# EAGLE design untitled (EAGLE 9.5.2)
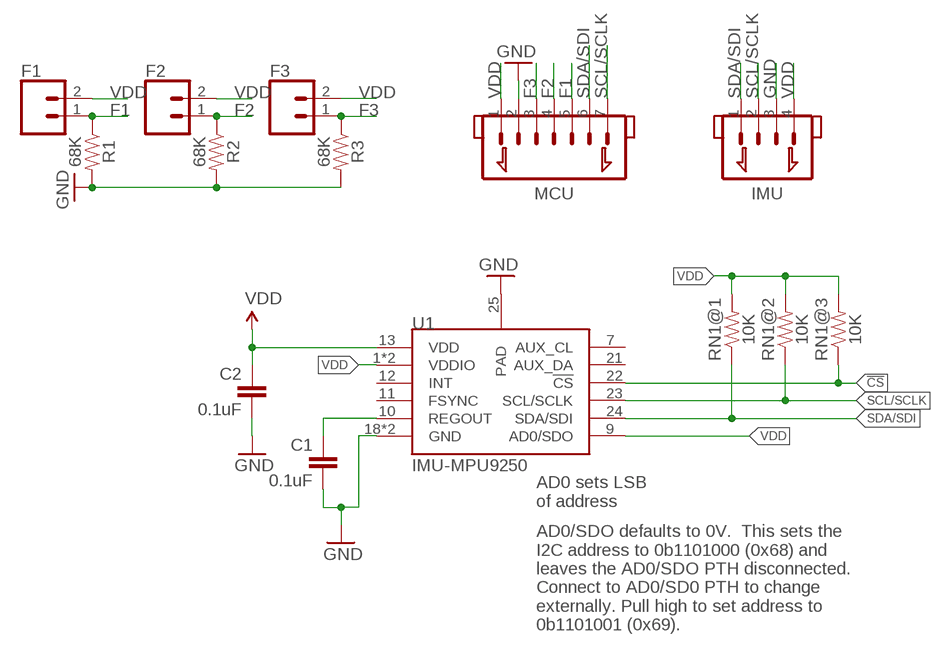
[diagram p0: schematic, sheet 1]

## Parts
C1  0.1uF  0.1UF-25V(+80/-20%)(0603)  [0603-CAP]
C2  0.1uF  0.1UF-25V(+80/-20%)(0603)  [0603-CAP]
F1  CONN_02LOCK_LONGPADS  [1X02_LOCK_LONGPADS]
F2  CONN_02LOCK_LONGPADS  [1X02_LOCK_LONGPADS]
F3  CONN_02LOCK_LONGPADS  [1X02_LOCK_LONGPADS]
IMU  JST_1.25_4P  [JST1.25_4P]
MCU  JST_1.25_7P  [JST1.25_7P]
R1  68K  RESISTOR0603  [0603]
R2  68K  RESISTOR0603  [0603]
R3  68K  RESISTOR0603  [0603]
RN1  10K  RESISTOR_ARRAY_1206_SEPARATE  [RESCAF80P320X160X60-8N]
U1  IMU-MPU9250  [LEAD-QFN24]

## Nets
!CS: RN1.3 U1.22(!CS)
F1: F1.1 MCU.5 R1.1
F2: F2.1 MCU.4 R2.1
F3: F3.1 MCU.3 R3.1
GND: C1.2 C2.2 IMU.3 MCU.2 R1.2 R2.2 R3.2 U1.18(GND) U1.20(GND) U1.25(PAD)
REGOUT: C1.1 U1.10(REGOUT)
SCL/SCLK: IMU.2 MCU.7 RN1.2 U1.23(SCL/SCLK)
SDA/SDI: IMU.1 MCU.6 RN1.1 U1.24(SDA/SDI)
VDD: C2.1 F1.2 F2.2 F3.2 IMU.4 MCU.1 RN1.6 RN1.7 RN1.8 U1.1(VDDIO) U1.8(VDDIO) U1.9(AD0/SDO) U1.13(VDD)
Unconnected: RN1.4 RN1.5 U1.7(AUX_CL) U1.11(FSYNC) U1.12(INT) U1.21(AUX_DA)

## Notes on the sheet
- AD0 sets LSB
  of address
- AD0/SDO defaults to 0V.  This sets the
  I2C address to 0b1101000 (0x68) and
  leaves the AD0/SDO PTH disconnected.
  Connect to AD0/SD0 PTH to change
  externally. Pull high to set address to
  0b1101001 (0x69).

## Library data of the parts
C1 C2 = SparkFun-Capacitors:0.1UF-25V(+80/-20%)(0603): CAP-00810 Ceramic Standard decoupling cap; PROD_ID: CAP-00810
F1-F3 = SparkFun-Connectors:CONN_02: Multi connection point. Often used as Generic Header-pin footprint for 0.1 inch spaced/style header connections On any of the 0.1 inch spaced packages, you can populate with these: Break Away Headers - Straight <https://www.sparkfun.com/products/116> (PRT-00116) Break Away Male Headers - Right Angle <https://www.sparkfun.com/products/553> (PRT-00553) Female Headers <https://www.sparkfun.com/products/115> (PRT-00115) Break Away Headers - Machine Pin <https://www.sparkfun.com/products/117> (PRT-00117) Break Away Female Headers - Swiss Machine Pin <https://www.sparkfun.com/products/743> (PRT-00743) For SCREWTERMINALS and SPRING TERMINALS visit here: Screw Terimnals on SparkFun.com <https://www.sparkfun.com/search/results?term=Screw+Terminals> (5mm/3.5mm/2.54mm spacing) This device is also useful as a general connection point to wire up your design to another part of your project. Our various solder wires solder well into these plated through hole pads. Hook-Up Wire - Assortment (Stranded, 22 AWG) <https://www.sparkfun.com/products/11375> (PRT-11375) Hook-Up Wire - Assortment (Solid Core, 22 AWG) <https://www.sparkfun.com/products/11367> (PRT-11367) View the entire wire category on our website here <https://www.sparkfun.com/categories/141> Special notes: Molex polarized connector foot print use with: PRT-08233 with associated crimp pins and housings. 2.54_SCREWTERM for use with PRT-10571. 3.5mm Screw Terminal footprints for PRT-08084 5mm Screw Terminal footprints for use with PRT-08432
IMU = Scott-Connectors:JST_1.25_4P
MCU = Scott-Connectors:JST_1.25_7P
R1-R3 = Scott-Electrical:RESISTOR: Generic Resistor Package
RN1 = Scott-Electrical:RESISTOR_ARRAY_1206_SEPARATE
U1 = Scott-ICs:IMU-MPU9250

## Board
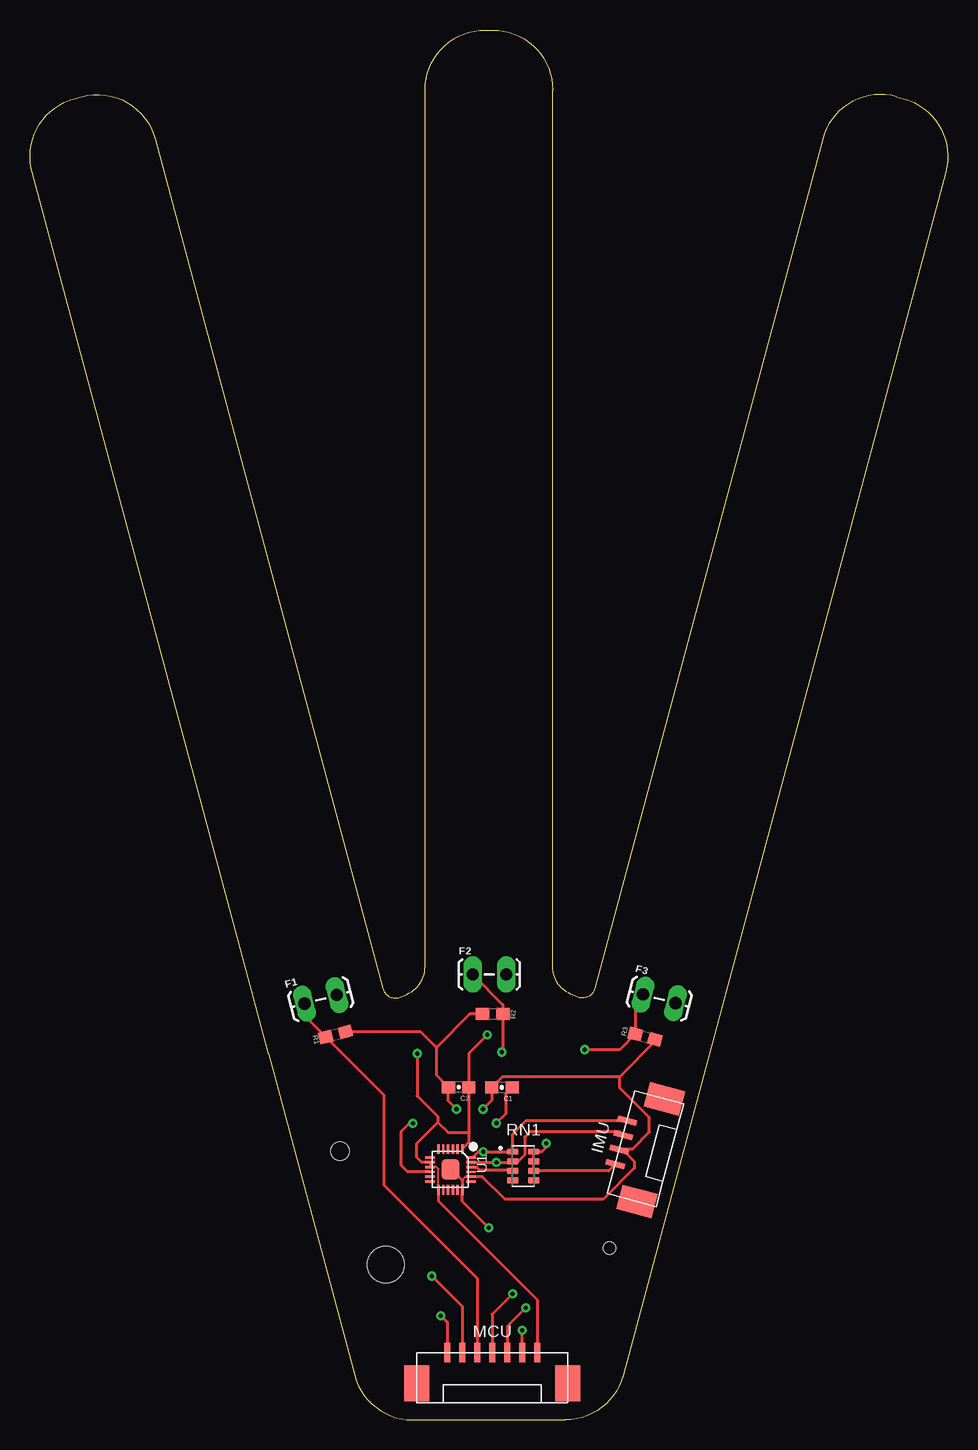
[diagram p1: board, top side]
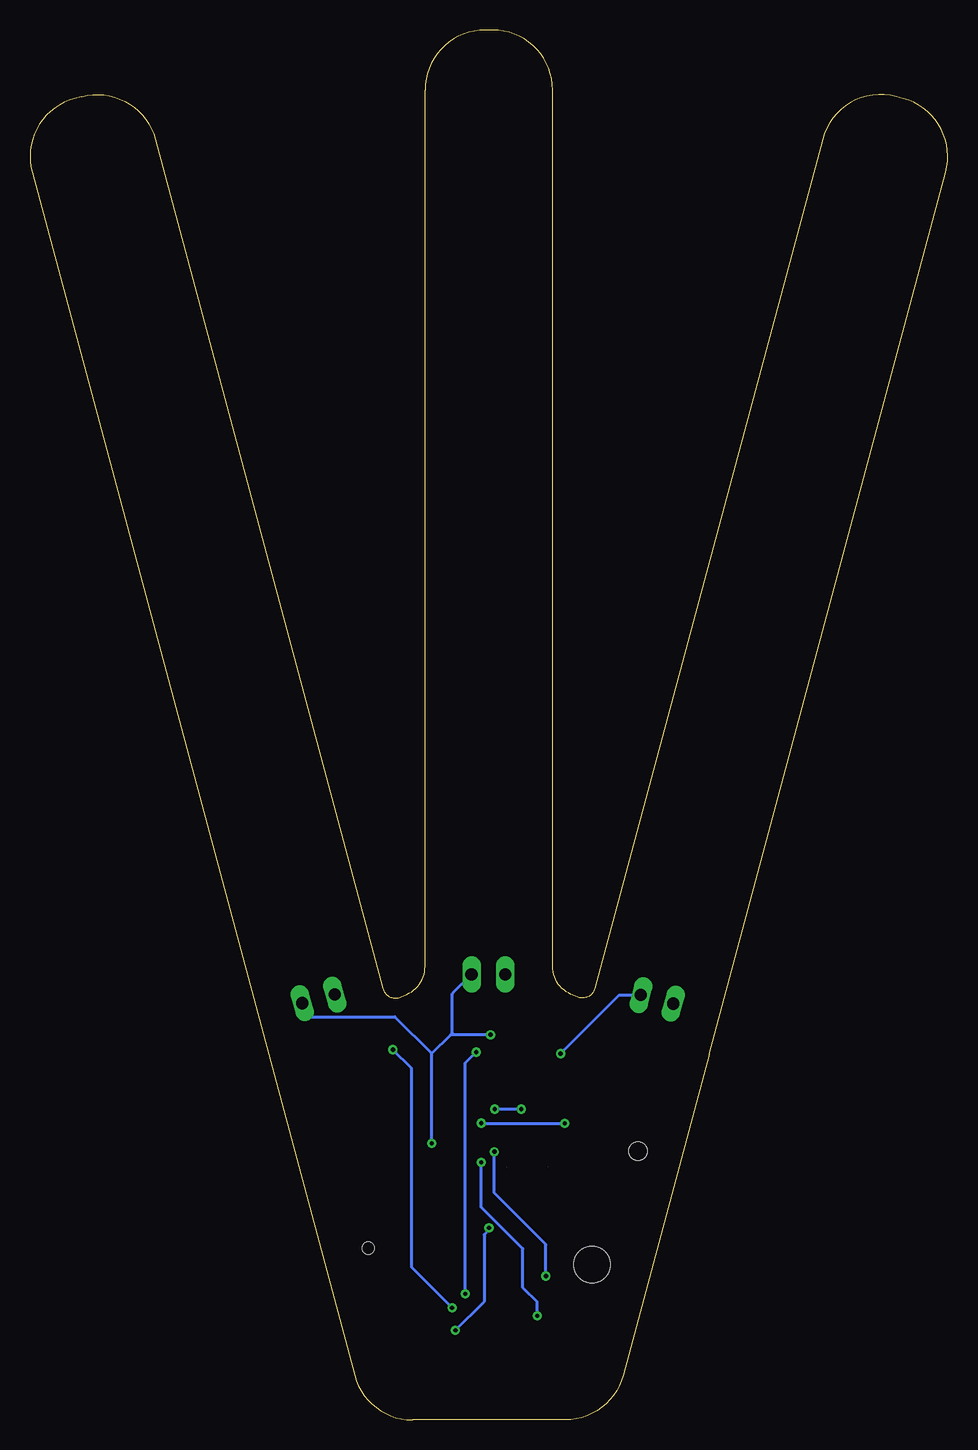
[diagram p2: board, bottom side, seen from below]

Size 76.48 x 115.87 mm. Coordinates in mm from the lower left corner, seen from the top.
Outline: 56.6,30.47 49.43,3.71 arc-75 44.6,0 31.88,0 arc-75 27.05,3.71 19.88,30.47 0.17,104.02 arc-90 3.71,110.15 4.31,110.31 arc-90 10.44,106.77 29.41,35.97 arc99 30.89,35.26 31.4,35.48 arc66 32.93,37.81 32.93,110.87 arc-90 37.93,115.87 38.56,115.87 arc-90 43.56,110.87 43.56,37.81 arc66 45.08,35.48 45.59,35.26 arc99 47.07,35.97 66.04,106.77 arc-90 72.17,110.31 72.78,110.15 arc-90 76.31,104.02 56.6,30.47
Copper layers (1*16): Top 0.035mm / dielectric 1.5mm / Bottom 0.035mm
Design rules "default": minimum track width 6mil, minimum drill 0.35mm, track to track 6mil, track to pad 6mil, pad to pad 6mil, via to via 6mil, smd to smd 6mil, copper to edge 40mil, drill to drill 6mil, minimum pad ring 10mil, minimum via ring 8mil, stop-mask expansion 4mil, vias tented up to drill 0mil, thermal gap 10mil
Holes 1 mm at 48.29,14.33
Holes 1.52 mm at 25.81,22.41
Holes 3.05 mm at 29.65,12.96

### Footprints (pad centres in the part's own frame; a part is rotated, then mirrored left to right if it is on the bottom)
0603-CAP = smd 1.1 x 1: 1 -0.85,0; 2 0.85,0
1X02_LOCK_LONGPADS = drill 1.016 long: 1 -0.127,0; 2 2.667,0
JST1.25_4P = smd 0.5 x 1.6: 1 0,0; 2 1.25,0; 3 2.5,0; 4 3.75,0 | smd 2.1 x 3: 5 -2.55,2.55; 6 6.3,2.55
JST1.25_7P = smd 0.5 x 1.6: 1 0,0; 2 1.25,0; 3 2.5,0; 4 3.75,0; 5 5,0; 6 6.25,0; 7 7.5,0 | smd 2.1 x 3: 8 -2.55,2.55; 9 10.05,2.55
0603 = smd 1.1 x 1: 1 -0.85,0; 2 0.85,0
RESCAF80P320X160X60-8N = smd 0.97 x 0.53: 1 -0.875,1.2; 2 -0.875,0.4; 3 -0.875,-0.4; 4 -0.875,-1.2; 5 0.875,-1.2; 6 0.875,-0.4; 7 0.875,0.4; 8 0.875,1.2
LEAD-QFN24 = smd 0.8 x 0.2: 1 -1.7,1; 2 -1.7,0.6; 3 -1.7,0.2; 4 -1.7,-0.2; 5 -1.7,-0.6; 6 -1.7,-1; 13 1.7,-1; 14 1.7,-0.6; 15 1.7,-0.2; 16 1.7,0.2; 17 1.7,0.6; 18 1.7,1 | smd 0.2 x 0.8: 7 -1,-1.7; 8 -0.6,-1.7; 9 -0.2,-1.7; 10 0.2,-1.7; 11 0.6,-1.7; 12 1,-1.7; 19 1,1.7; 20 0.6,1.7; 21 0.2,1.7; 22 -0.2,1.7; 23 -0.6,1.7; 24 -1,1.7 | smd 1.7 x 1.54: 25 0,0

### Placement (x,y rotation side)
C1  39.33,27.71 180 top
C2  35.72,27.74 180 top
F1  23,34.73 15 top
F2  37.01,37.14 0 top
F3  51.21,35.43 345 top
IMU  49.75,24.95 255 top
MCU  42.27,5.62 180 top
R1  25.47,32.13 15 top
R2  38.56,33.84 180 top
R3  51.26,31.94 345 top
RN1  41.1,21.16 0 top
U1  35.03,20.88 270 top

### Tracks (layer width: path | path; a pad name or v marks a point on that pad's centre or on a via)
!CS  (1 unrouted)
  Top 0.152: 36.76,21.06 U1.22 | RN1.3 40.2,20.79
  Top 0.254: 36.76,21.06 37.25,21.06 37.52,20.79 40.2,20.79
F1
  Top 0.254: F1.1 22.88,33.68 R1.1 29.48,27.08 29.48,19.58 37.27,11.79 MCU.5
F2  (via drill 0.35)
  Top 0.254: F2.1 39.41,34.61 R2.1 39.41,30.77 v39.3,30.66 | v40.22,10.52 38.51,8.82 38.51,5.62 MCU.4
  Bottom 0.254: v39.3,30.66 40.22,29.75 v40.22,10.52
F3  (via drill 0.35)
  Top 0.254: 50.38,34.76 F3.1 50.43,34.81 R3.1 | 50.51,32.24 R3.1 | v41.31,9.35 39.77,7.81 MCU.3 | R3.1 49.14,30.86 v46.23,30.86
  Bottom 0.254: v41.31,9.35 44.69,12.73 44.69,29.31 v46.23,30.86
GND  (via drill 0.35)
  Top 0.152: R3.2 52.08,31.54 | U1.20 | 49.38,22.54 IMU.3 49.16,22.59 | 33.89,31.06 33.86,31.04 | U1.25 35.14,20.88 | 38.48,27.73 C1.2 | v41.02,7.46 v41.03,7.47 | 36.03,19.89 36.03,20 36.32,20.29
  Top 0.254: 52.08,31.54 49.14,28.61 | 49.14,28.61 39.36,28.61 38.48,27.73 | 36.32,20.29 U1.20 | 49.38,22.54 50.37,21.54 50.37,21.01 47.76,18.4 39.59,18.4 37.71,20.28 U1.20 | 33.86,31.04 32.55,32.35 R1.2 | R2.2 36.66,33.84 33.89,31.06 33.89,28.72 C2.2 34.87,26.58 v35.54,25.91 | C1.2 38.48,26.64 v37.75,25.91 | 35.14,20.88 36.03,19.98 36.03,19.89 U1.18 36.03,18.2 v38.23,16 | 49.16,22.59 50.21,22.59 51.62,24 51.62,25.22 49.14,27.69 49.14,28.61 | MCU.2 v41.02,7.46
  Bottom 0.254: v37.75,25.91 v35.54,25.91 | v41.03,7.47 38.64,9.86 38.64,15.45 38.23,15.85 v38.23,16
REGOUT  (via drill 0.35)
  Top 0.254: U1.10 31.49,20.68 30.9,21.27 30.9,24.01 31.6,24.72 v31.91,24.72 | v38.87,24.74 39.63,25.5 39.63,27.17 C1.1
  Bottom 0.254: v38.87,24.74 38.84,24.72 v31.91,24.72
SCL/SCLK  (via drill 0.35)
  Top 0.152: 40.15,21.48 RN1.2 40.7,21.56 | IMU.2 49.18,24
  Top 0.254: U1.23 v38.87,21.48 40.15,21.48 | 49.18,24 41.64,24 41.21,23.57 41.21,22.07 40.7,21.56 | v34.22,8.69 34.77,8.14 MCU.7
  Bottom 0.254: v34.22,8.69 34.22,9.83 35.42,11.03 35.42,14.27 38.87,17.73 v38.87,21.48
SDA/SDI  (via drill 0.35)
  Top 0.254: IMU.1 41.35,24.95 40.23,23.83 RN1.1 v37.78,22.36 37.37,22.36 36.89,21.88 U1.24 | v33.48,11.99 36.02,9.45 MCU.6
  Bottom 0.254: v33.48,11.99 33.48,14.63 37.78,18.93 v37.78,22.36
VDD  (via drill 0.35)  (1 unrouted)
  Top 0.152: U1.9 33.87,21.08 34.03,20.92 U1.13 | U1.8
  Top 0.254: U1.13 34.03,18.25 42.27,10.01 MCU.1 | IMU.4 48.21,20.76 RN1.6 RN1.7 RN1.8 42.66,22.36 43.01,22.71 v43.01,23.07 | v38.11,32.11 36.57,30.57 C2.1 36.57,23.95 | U1.8 32.64,21.48 32.2,21.92 32.2,23.02 33.99,24.81 | U1.8 U1.9 | v32.26,30.53 32.26,27 33.98,25.29 33.98,24.82 33.99,24.81 | 36.57,23.95 36.57,23.12 U1.1 | 36.57,23.95 34.85,23.95 33.99,24.81
  Bottom 0.254: v32.26,30.53 27.38,35.42 F1.2 | F2.2 41.28,35.54 41.28,32.26 41.43,32.11 | 43.03,23.09 v43.01,23.07 43.01,30.53 | 43.01,30.53 41.43,32.11 | v38.11,32.11 41.43,32.11 | F3.2 53.78,34.36 53.03,33.6 46.08,33.6 43.01,30.53